# EAGLE design bebox_main_itsybitsy (EAGLE 9.3.2)
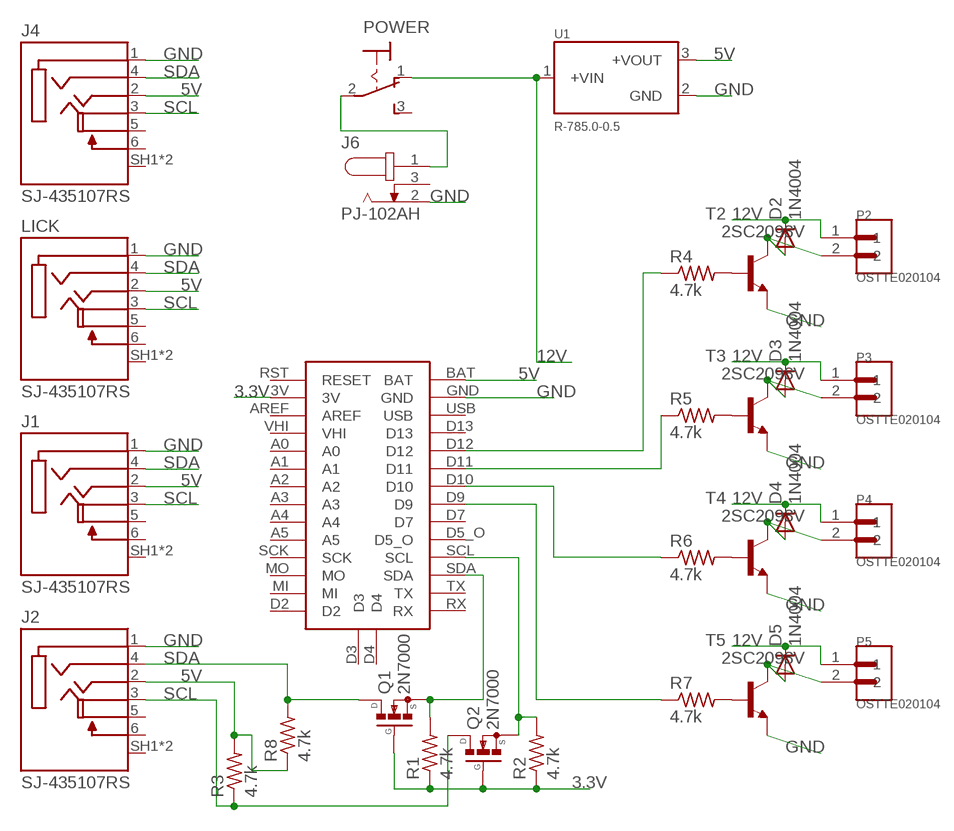
[diagram p0: schematic, sheet 1]

## Parts
D2  1N4004  [DO41-10]
D3  1N4004  [DO41-10]
D4  1N4004  [DO41-10]
D5  1N4004  [DO41-10]
J1  SJ-435107RS  [CUI_SJ-435107RS]
J2  SJ-435107RS  [CUI_SJ-435107RS]
J4  SJ-435107RS  [CUI_SJ-435107RS]
J6  PJ-102AH  [CUI_PJ-102AH]
LICK  SJ-435107RS  [CUI_SJ-435107RS]
P2  OSTTE020104  [OST_OSTTE020104]
P3  OSTTE020104  [OST_OSTTE020104]
P4  OSTTE020104  [OST_OSTTE020104]
P5  OSTTE020104  [OST_OSTTE020104]
POWER  SWITCH_APEM_5636AB9  [320-916]
Q1  2N7000  [TO92]
Q2  2N7000  [TO92]
R1  4.7k  R-US_0207/10  [0207/10]
R2  4.7k  R-US_0207/10  [0207/10]
R3  4.7k  R-US_0207/10  [0207/10]
R4  4.7k  R-US_0207/10  [0207/10]
R5  4.7k  R-US_0207/10  [0207/10]
R6  4.7k  R-US_0207/10  [0207/10]
R7  4.7k  R-US_0207/10  [0207/10]
R8  4.7k  R-US_0207/10  [0207/10]
T2  2SC2098V  [TO220AV]
T3  2SC2098V  [TO220AV]
T4  2SC2098V  [TO220AV]
T5  2SC2098V  [TO220AV]
U1  R-785.0-0.5  [RECOM_R-785.0-0.5]
U$1  ITSYBITSYM4  [ITSYBITSYM4]

## Nets
3.3V: Q1.2(G) Q2.2(G) R1.1 R2.1 U$1.3V
5V: J1.2(TIP) J2.2(TIP) J4.2(TIP) LICK.2(TIP) R3.2 R8.1 U1.3(+VOUT) U$1.BAT
12V: D2.C D3.C D4.C D5.C P2.1 P3.1 P4.1 P5.1 POWER.1(O) U1.1(+VIN)
GND: J1.1(SLEEVE) J2.1(SLEEVE) J4.1(SLEEVE) J6.2 LICK.1(SLEEVE) T2.3(E) T3.3(E) T4.3(E) T5.3(E) U1.2(GND) U$1.GND
N$1: J6.1 POWER.2(P)
N$2: Q1.1(S) R1.2 U$1.SDA
N$3: Q2.1(S) R2.2 U$1.SCL
N$4: R4.2 T2.1(B)
N$5: D2.A P2.2 T2.2(C)
N$6: R5.2 T3.1(B)
N$7: D3.A P3.2 T3.2(C)
N$8: R6.2 T4.1(B)
N$9: D4.A P4.2 T4.2(C)
N$10: R7.2 T5.1(B)
N$11: D5.A P5.2 T5.2(C)
N$12: R7.1 U$1.D9
N$13: R6.1 U$1.D10
N$14: R5.1 U$1.D11
N$15: R4.1 U$1.D12
SCL: J1.3(RING1) J2.3(RING1) J4.3(RING1) LICK.3(RING1) Q2.3(D) R3.1
SDA: J1.4(RING2) J2.4(RING2) J4.4(RING2) LICK.4(RING2) Q1.3(D) R8.2
Unconnected: J1.5(ISOLATED_RING1) J1.6(ISOLATED_RING1_SWITCH(N-O)) J1.SH1(SHIELD) J1.SH2(SHIELD) J2.5(ISOLATED_RING1) J2.6(ISOLATED_RING1_SWITCH(N-O)) J2.SH1(SHIELD) J2.SH2(SHIELD) J4.5(ISOLATED_RING1) J4.6(ISOLATED_RING1_SWITCH(N-O)) J4.SH1(SHIELD) J4.SH2(SHIELD) J6.3 LICK.5(ISOLATED_RING1) LICK.6(ISOLATED_RING1_SWITCH(N-O)) LICK.SH1(SHIELD) LICK.SH2(SHIELD) POWER.3(S) U$1.A0 U$1.A1 U$1.A2 U$1.A3 U$1.A4 U$1.A5 U$1.AREF U$1.D2 U$1.D3 U$1.D4 U$1.D5_O U$1.D7 U$1.D13 U$1.MI U$1.MO U$1.RST(RESET) U$1.RX U$1.SCK U$1.TX U$1.USB U$1.VHI

## Library data of the parts
D2-D5 = adafruit:1N4004: DIODE General purpose 1N400x type rectifier (With bigger pads) http://www.ladyada.net/library/pcb/eaglelibrary.html
J1 J2 J4 LICK = SJ-435107RS:SJ-435107RS: 3.5 mm Right Angle Shielded (0.141", 1/8", Mini Plug) Female HeadPhone Jack; AVAILABILITY: Good; DESCRIPTION: 3.5 mm Right Angle Shielded _0.141, 1/8, Mini Plug_ Female HeadPhone Jack; MF: CUI; MP: SJ-435107RS; PACKAGE: None; PRICE: 1.04 USD
J6 = PJ-102AH:PJ-102AH: 2.0 mm Center Pin, 5.0 A, Right Angle, Through Hole, Tapered Pins, Dc Power Jack Connector; MANUFACTURER: CUI INC; PART_REV: 1.02; STANDARD: Manufacturer recommendations
P2-P5 = OSTTE020104:OSTTE020104: Terminal Block 3.5mm 2pos Pcb; DESCRIPTION: Terminal Block 3.5mm 2pos Pcb; DIGI-KEY_PART_NUMBER: ED2740-ND; DIGI-KEY_PURCHASE_URL: https://www.digikey.com/product-detail/en/on-shore-technology-inc/OSTTE020104/ED2740-ND/2351816?utm_source=snapeda&utm_medium=aggregator&utm_campaign=symbol; MF: On Shore; MP: OSTTE020104; PACKAGE: None
POWER = arthur:SWITCH_APEM_5636AB9: TOGGLE SWITCH distributor RS Components
Q1 Q2 = 2N7000:2N7000: N-Channel Mosfet [S]-G-D pinout 2n7000: http://smallbear-electronics.mybigcommerce.com/transistor-fet-2n7000/; AVAILABILITY: Unavailable; DESCRIPTION: MOSFETs- Power and Small Signal 60V 200mA N-Channel No-Cancel/No-Return; MF: STMicroelectronics; MP: 2N7000; PACKAGE: TO-92 ON Semiconductor; PRICE: None
R1-R8 = rcl:R-US_: RESISTOR, American symbol; SPICEPREFIX: R
T2-T5 = transistor:2SC2098: NPN Epitaxial Planar Transistor RF Power Amplivier Source: 2SC2098.pdf
U1 = R-785.0-0.5:R-785.0-0.5: Switching Regulator, 0.5 Amp, Sip 3, 5vsingle Output, High Efficiency; DESCRIPTION: Switching Regulator, 0.5 Amp, Sip 3, 5vsingle Output, High Efficiency; DIGI-KEY_PART_NUMBER: 945-1037-ND; DIGI-KEY_PURCHASE_URL: https://www.digikey.com/product-detail/en/recom-power/R-785.0-0.5/945-1037-ND/2256217?utm_source=snapeda&utm_medium=aggregator&utm_campaign=symbol; MF: Recom Power; MP: R-785.0-0.5; PACKAGE: SIP-3 Recom Power
U$1 = arthur:ITSYBITSYM4

## Board
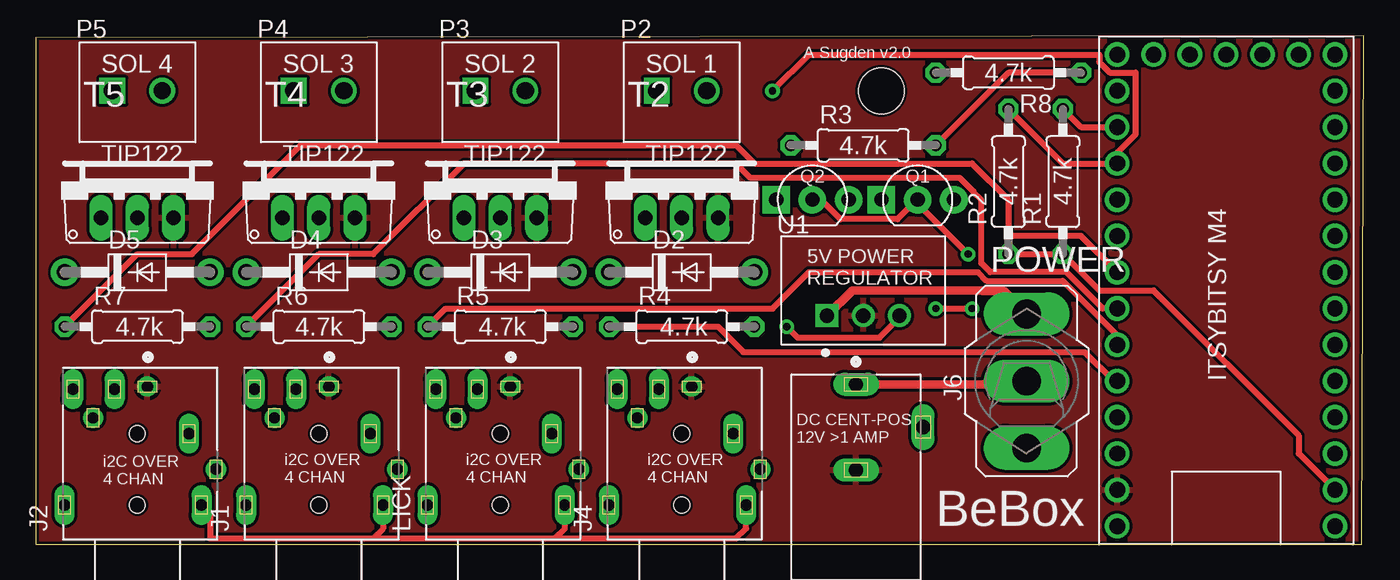
[diagram p1: board, top side]
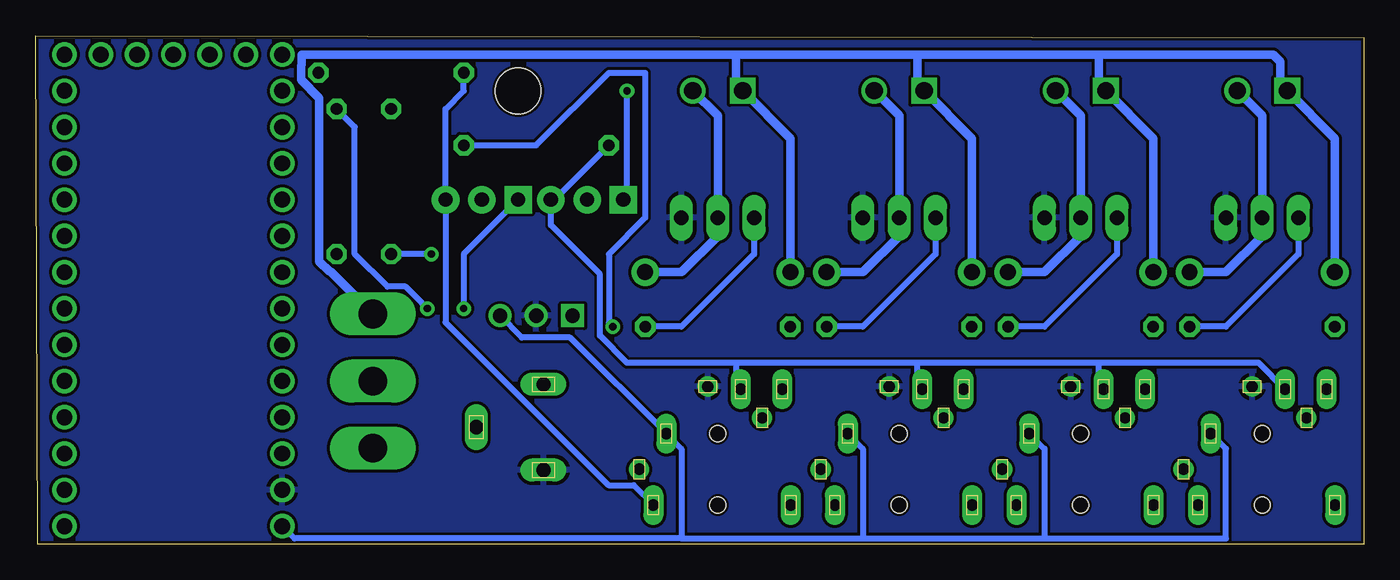
[diagram p2: board, bottom side, seen from below]

Size 92.94 x 35.61 mm. Coordinates in mm from the lower left corner, seen from the top.
Outline: 0,0 92.82,0 92.94,35.61 0,35.48 0,0
Copper layers (1*16): Top 0.035mm / dielectric 1.5mm / Bottom 0.035mm
Design rules "SparkFun": minimum track width 8mil, minimum drill 20mil, track to track 8mil, track to pad 8mil, pad to pad 8mil, via to via 8mil, smd to smd 8mil, copper to edge 8mil, drill to drill 8mil, minimum pad ring 12mil, minimum via ring 10mil, stop-mask expansion 4mil, vias tented up to drill 20mil, thermal gap 10mil
Holes 3.2 mm at 59.18,31.75

### Footprints (pad centres in the part's own frame; a part is rotated, then mirrored left to right if it is on the bottom)
DO41-10 = drill 1.118 pad 1.93: A 5.08,0; C -5.08,0
CUI_SJ-435107RS = drill 0.8 pad 1.1: 1 4.7,-0.7; 5 2.5,3.1; SH2 -1.1,-5.5 | drill 0.8 pad 1.1 long: 2 1.4,-3.6; 3 4.5,1.6; 4 -3.6,-4.5; 6 4.5,4.5; SH1 -3.6,5.1 | hole 1.1: -3.6,0; 1.4,0
CUI_PJ-102AH = drill 1 long: 1 -6.5,0; 2 -0.5,0; 3 -3.5,4.7
OST_OSTTE020104 = drill 1.2 square: 1 -1.75,0 | drill 1.2: 2 1.75,0
320-916 = drill 2.007 long: 1 0,4.699; 2 0,0; 3 0,-4.699
TO92 = drill 1 pad 1.93 square: 1 -2.54,0 | drill 1 pad 1.93: 2 0,0; 3 2.54,0
0207/10 = drill 0.813 octagon: 1 -5.08,0; 2 5.08,0
TO220AV = drill 1.016 long: 1 -2.54,-2.54; 2 0,-2.54; 3 2.54,-2.54
RECOM_R-785.0-0.5 = drill 1 square: 1 -2.54,-1.775 | drill 1: 2 0,-1.775; 3 2.54,-1.775
ITSYBITSYM4 = drill 1.11: 3V -12.7,-7.62; A0 -5.08,-7.62; A1 -2.54,-7.62; A2 0,-7.62; A3 2.54,-7.62; A4 5.08,-7.62; A5 7.62,-7.62; AREF -10.16,-7.62; BAT -15.24,7.62; D2 17.78,-7.62; D3 17.78,2.54; D4 17.78,5.08; D5_O 7.62,7.62; D7 5.08,7.62; D9 2.54,7.62; D10 0,7.62; D11 -2.54,7.62; D12 -5.08,7.62; D13 -7.62,7.62; GND -12.7,7.62; MI 15.24,-7.62; MO 12.7,-7.62; P$1 17.78,0; P$3 17.78,-2.54; P$4 17.78,-5.08; RST -15.24,-7.62; RX 17.78,7.62; SCK 10.16,-7.62; SCL 10.16,7.62; SDA 12.7,7.62; TX 15.24,7.62; USB -10.16,7.62; VHI -7.62,-7.62

### Placement (x,y rotation side)
D2  45.21,19.05 0 top
D3  32.51,19.05 0 top
D4  19.81,19.05 0 top
D5  7.11,19.05 0 top
J1  19.81,6.35 90 top
J2  7.11,6.35 90 top
J4  45.21,6.35 90 top
J6  57.4,4.7 270 top
LICK  32.51,6.35 90 top
P2  45.21,31.75 0 top
P3  32.51,31.75 0 top
P4  19.81,31.75 0 top
P5  7.11,31.75 0 top
POWER  69.34,11.43 0 top
Q1  61.72,24.13 0 top
Q2  54.36,24.13 0 top
R1  71.88,25.4 90 top
R2  68.07,25.4 90 top
R3  57.91,27.94 0 top
R4  45.21,15.24 0 top
R5  32.51,15.24 0 top
R6  19.81,15.24 0 top
R7  7.11,15.24 0 top
R8  68.07,33.02 180 top
T2  45.21,25.4 0 top
T3  32.51,25.4 0 top
T4  19.81,25.4 0 top
T5  7.11,25.4 0 top
U1  57.91,17.78 0 top
U$1  83.31,16.51 90 top

### Tracks (layer width: path | path; a pad name or v marks a point on that pad's centre or on a via)
3.3V  (via drill 0.51)
  Top 0.406: U$1.3V 88.39,6.35 88.39,7.62 78.23,17.78 74.42,17.78 R1.1 R2.1 | v65.25,20.32 61.72,23.85 Q1.2 61.69,24.13 60.32,22.76 56.33,22.76 54.96,24.13 Q2.2
  Bottom 0.406: v65.25,20.32 R2.1
5V  (via drill 0.51)
  Top 0.406: R8.1 68.07,33.02 R3.2 | v52.55,15.24 53.31,14.48 59.06,14.48 60.45,15.88 U1.3
  Bottom 0.406: 47.75,0.41 35.05,0.41 | 35.05,0.41 22.35,0.41 | 22.35,0.41 9.65,0.41 9.65,6.69 J2.2 | J1.2 22.35,6.69 22.35,0.41 | LICK.2 35.05,6.69 35.05,0.41 | 47.75,0.41 47.75,6.69 J4.2 55.54,14.48 58.92,14.48 U1.3 | 47.75,0.41 74.83,0.41 U$1.BAT | R3.2 57.91,27.94 52.83,33.02 50.29,33.02 50.29,22.86 52.83,20.32 52.83,15.52 v52.55,15.24
12V
  Top 0.61: U1.1 57.15,17.78 66.2,17.78 66.26,17.73 67.74,17.73 POWER.1
  Bottom 0.61: D4.C 14.73,28.42 P4.1 18.54,32.23 18.54,34.29 | D5.C 2.03,28.42 P5.1 5.84,32.23 5.84,33.79 6.34,34.29 18.54,34.29 | D3.C 27.43,28.42 P3.1 31.24,32.23 31.24,34.29 | D2.C 40.13,28.42 P2.1 43.94,32.23 43.94,34.29 | 43.94,34.29 66.8,34.29 74.32,34.29 74.32,33.57 74.37,33.53 74.37,32.52 73.1,31.25 73.1,19.82 72.39,19.1 72.31,19.1 POWER.1 | 43.94,34.29 31.24,34.29 | 31.24,34.29 18.54,34.29
GND
  pour Top: -0.51,35.56 -0.51,0 93.47,0 93.47,35.56
  pour Bottom: -0.51,35.56 -0.51,0 93.47,0 93.47,35.56
N$1
  Top 0.61: J6.1 69.11,11.2 POWER.2
N$2  (via drill 0.51)
  Top 0.406: R1.2 73.15,29.21 U$1.SDA | v62.99,16.51 v65.53,16.51
  Bottom 0.406: Q1.1 62.99,20.32 v62.99,16.51 | v65.53,16.51 65.93,16.9 65.93,16.92 67.05,18.04 68.33,18.04 70.61,20.32 70.61,29.21 R1.2
N$3  (via drill 0.51)
  Top 0.406: v51.56,31.75 54.1,34.29 74.42,34.29 74.43,34.29 74.43,33.77 75.17,33.02 76.96,33.02 76.96,28.69 75.69,27.42 U$1.SCL 71.88,26.67 R2.2
  Bottom 0.406: Q2.1 51.56,24.38 v51.56,31.75
N$4
  Bottom 0.406: T2.1 42.67,20.32 47.75,15.24 R4.2
N$5
  Bottom 0.61: P2.2 45.21,30 T2.2 45.21,21.59 47.75,19.05 D2.A
N$6
  Bottom 0.406: T3.1 29.97,20.32 35.05,15.24 R5.2
N$7
  Bottom 0.61: P3.2 32.51,30 T3.2 32.51,21.59 35.05,19.05 D3.A
N$8
  Bottom 0.406: T4.1 17.27,20.32 22.35,15.24 R6.2
N$9
  Bottom 0.61: P4.2 19.81,30 T4.2 19.81,21.59 22.35,19.05 D4.A
N$10
  Bottom 0.406: T5.1 4.57,20.32 9.65,15.24 R7.2
N$11
  Bottom 0.61: P5.2 7.11,30 T5.2 7.11,21.59 9.65,19.05 D5.A
N$12
  Top 0.406: R7.1 7.11,20.32 10.92,20.32 18.54,27.94 49.02,27.94 50.29,26.67 65.53,26.67 68.07,24.13 68.07,21.59 73.15,21.59 U$1.D9
N$13
  Top 0.406: R6.1 19.81,20.32 23.62,20.32 29.97,26.67 49.02,26.67 50.04,25.65 64.68,25.65 65.63,24.7 65.63,24.66 66.17,24.13 66.17,19.68 66.8,19.05 72.14,19.05 74.67,16.51 U$1.D10
N$14
  Top 0.406: R5.1 28.7,16.51 51.56,16.51 54.1,19.05 65.94,19.05 66.55,18.44 71.88,18.44 75.69,14.63 U$1.D11
N$15
  Top 0.406: R4.1 47.75,15.24 49.53,13.46 73.41,13.46 75.44,11.43 U$1.D12
SCL
  Bottom 0.406: J2.3 7.36,12.7 18.54,12.7 | 18.54,12.7 31.24,12.7 | 31.24,12.7 43.94,12.7 | 43.94,12.7 43.94,11.18 J4.3 | LICK.3 31.24,11.18 31.24,12.7 | J1.3 18.54,11.18 18.54,12.7 | 43.94,12.7 51.56,12.7 53.47,14.61 53.47,18.92 56.9,22.35 Q2.3 56.64,24.13 R3.1
SDA
  Top 0.406: J2.4 12.19,2.17 12.19,0.41 23.62,0.41 | 23.62,0.41 36.32,0.41 | 36.32,0.41 49.02,0.41 49.71,1.1 J4.4 | LICK.4 37.01,1.1 36.32,0.41 | J1.4 24.31,1.1 23.62,0.41
  Bottom 0.406: R8.2 62.99,31.75 64.26,30.48 Q1.3 64.26,15.54 52.86,4.14 51.1,4.14 J4.4

### Text on the board
tPlace: A Sugden v2.0 | 4.7k | SOL 4 | SOL 3 | SOL 2 | SOL 1 | 4.7k | TIP122 | TIP122 | TIP122 | TIP122 | 4.7k | 4.7k | 4.7k | 4.7k | 4.7k | 4.7k | DC CENT-POS / 12V >1 AMP | i2C OVER / 4 CHAN | i2C OVER / 4 CHAN | i2C OVER / 4 CHAN | i2C OVER / 4 CHAN | BeBox
tNames: 5V POWER / REGULATOR